# EAGLE design Leds (EAGLE 6.3)
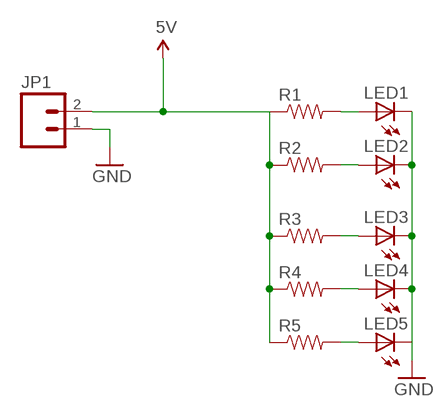
[diagram p0: schematic, sheet 1]

## Parts
JP1  M02LOCK_LONGPADS  [1X02_LOCK_LONGPADS]
LED1  LED5MM  [LED5MM]
LED2  LED5MM  [LED5MM]
LED3  LED5MM  [LED5MM]
LED4  LED5MM  [LED5MM]
LED5  LED5MM  [LED5MM]
R1  RESISTOR0805-RES  [0805]
R2  RESISTOR0805-RES  [0805]
R3  RESISTOR0805-RES  [0805]
R4  RESISTOR0805-RES  [0805]
R5  RESISTOR0805-RES  [0805]

## Nets
5V: JP1.2 R1.1 R2.1 R3.1 R4.1 R5.1
GND: JP1.1 LED1.K(C) LED2.K(C) LED3.K(C) LED4.K(C) LED5.K(C)
N$2: LED1.A R1.2
N$3: LED2.A R2.2
N$4: LED3.A R3.2
N$5: LED4.A R4.2
N$6: LED5.A R5.2

## Library data of the parts
JP1 = SparkFun-Connectors:M02: Header 2 Standard 2-pin 0.1" header. Use with straight break away headers (SKU : PRT-00116), right angle break away headers (PRT-00553), swiss pins (PRT-00743), machine pins (PRT-00117), and female headers (PRT-00115). Molex polarized connector foot print use with SKU : PRT-08233 with associated crimp pins and housings.
LED1-LED5 = SparkFun-LED:LED: LEDs Standard schematic elements and footprints for 5mm, 3mm, 1206, and 0603 sized LEDs. 5mm - Spark Fun Electronics SKU : COM-00529 (and others)
R1-R5 = SparkFun-Resistors:RESISTOR: Resistor Basic schematic elements and footprints for 0603, 1206, and PTH resistors.

## Board
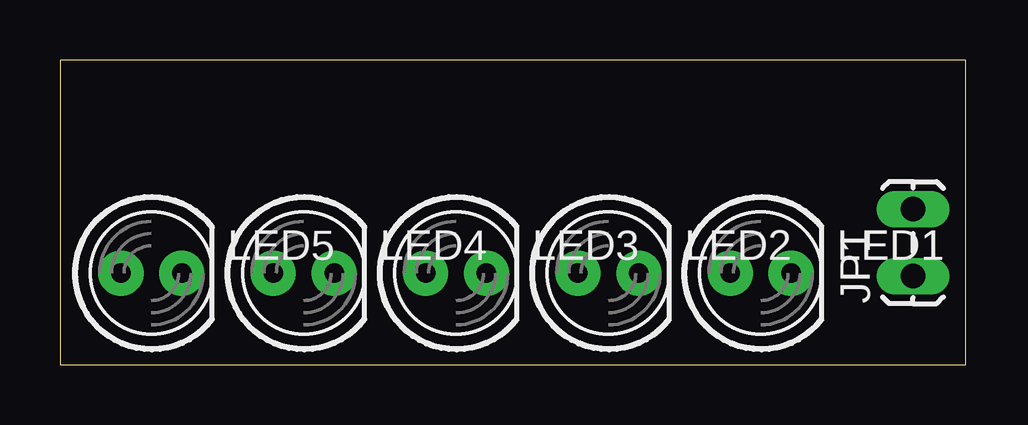
[diagram p1: board, top side]
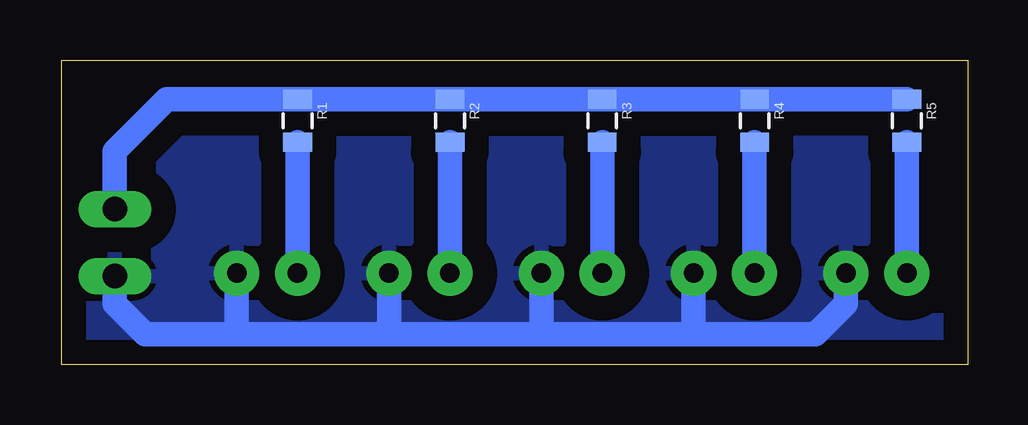
[diagram p2: board, bottom side, seen from below]

Size 37.77 x 12.69 mm. Coordinates in mm from the lower left corner, seen from the top.
Outline: 0,0 37.77,0 37.77,12.69 0,12.69 0,0
Copper layers (1*16): Top 0.035mm / dielectric 1.5mm / Bottom 0.035mm
Design rules "default": minimum track width 10mil, minimum drill 24mil, track to track 8mil, track to pad 8mil, pad to pad 8mil, via to via 8mil, smd to smd 8mil, copper to edge 40mil, drill to drill 8mil, minimum pad ring 10mil, minimum via ring 8mil, stop-mask expansion 4mil, vias tented up to drill 0mil, thermal gap 10mil

### Footprints (pad centres in the part's own frame; a part is rotated, then mirrored left to right if it is on the bottom)
1X02_LOCK_LONGPADS = drill 1.016 long: 1 -0.127,0; 2 2.667,0
LED5MM = drill 0.813 pad 1.88: A -1.27,0; K 1.27,0
0805 = smd 0.8 x 1.2: 1 -0.9,0; 2 0.9,0

### Placement (x,y rotation side)
JP1  35.56,3.81 90 top
LED1  29.21,3.81 0 top
LED2  22.86,3.81 0 top
LED3  16.51,3.81 0 top
LED4  10.16,3.81 0 top
LED5  3.81,3.81 0 top
R1  27.94,10.16 270 bottom
R2  21.59,10.16 270 bottom
R3  15.24,10.16 270 bottom
R4  8.89,10.16 270 bottom
R5  2.54,10.16 270 bottom

### Tracks (layer width: path | path; a pad name or v marks a point on that pad's centre or on a via)
5V
  Bottom 1.016: JP1.2 35.56,8.89 33.39,11.06 R1.1 R2.1 R3.1 R4.1 R5.1
GND
  Bottom 1.016: LED5.K 5.08,2.54 6.35,1.27 11.43,1.27 | 11.43,1.27 17.78,1.27 | 17.78,1.27 24.13,1.27 | 24.13,1.27 30.48,1.27 | 30.48,1.27 34.29,1.27 35.56,2.54 JP1.1 | LED1.K 30.48,1.27 | LED2.K 24.13,1.27 | LED3.K 17.78,1.27 | LED4.K 11.43,1.27
  pour Bottom (isolate 1.016): 0,12.7 0,0 38.1,0 38.1,12.7
N$2
  Bottom 1.016: R1.2 LED1.A
N$3
  Bottom 1.016: R2.2 LED2.A
N$4
  Bottom 1.016: R3.2 LED3.A
N$5
  Bottom 1.016: R4.2 LED4.A
N$6
  Bottom 1.016: R5.2 LED5.A